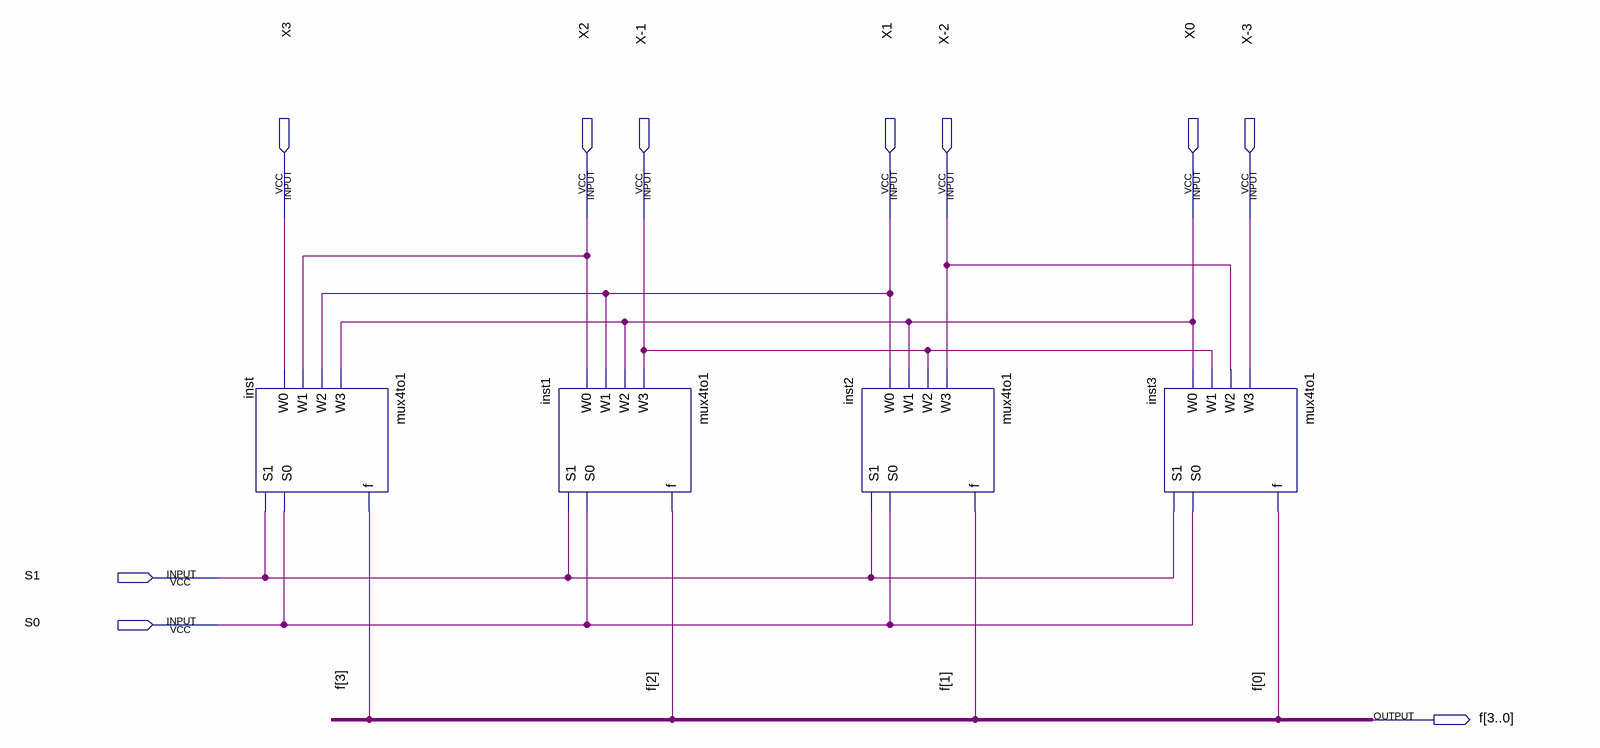
[diagram p0: schematic sheet]
// Quartus schematic shifter - Copy.bdf as structural Verilog: 4 symbols, 10 pins
module \shifter_-_Copy  (
  input  X3,
  input  X2,
  input  \X-1 ,
  input  X1,
  input  \X-2 ,
  input  X0,
  input  \X-3 ,
  input  S1,
  input  S0,
  output [3:0] f
);

  mux4to1 inst (.S1(S1), .S0(S0), .W0(X3), .W1(X2), .W2(X1), .W3(X0), .f(f[3]));
  mux4to1 inst1 (.S1(S1), .S0(S0), .W0(X2), .W1(X1), .W2(X0), .W3(\X-1 ), .f(f[2]));
  mux4to1 inst2 (.S1(S1), .S0(S0), .W0(X1), .W1(X0), .W2(\X-1 ), .W3(\X-2 ), .f(f[1]));
  mux4to1 inst3 (.S1(S1), .S0(S0), .W0(X0), .W1(\X-1 ), .W2(\X-2 ), .W3(\X-3 ), .f(f[0]));
endmodule
